# EAGLE design lpc1102_revb (EAGLE 6.5.0)
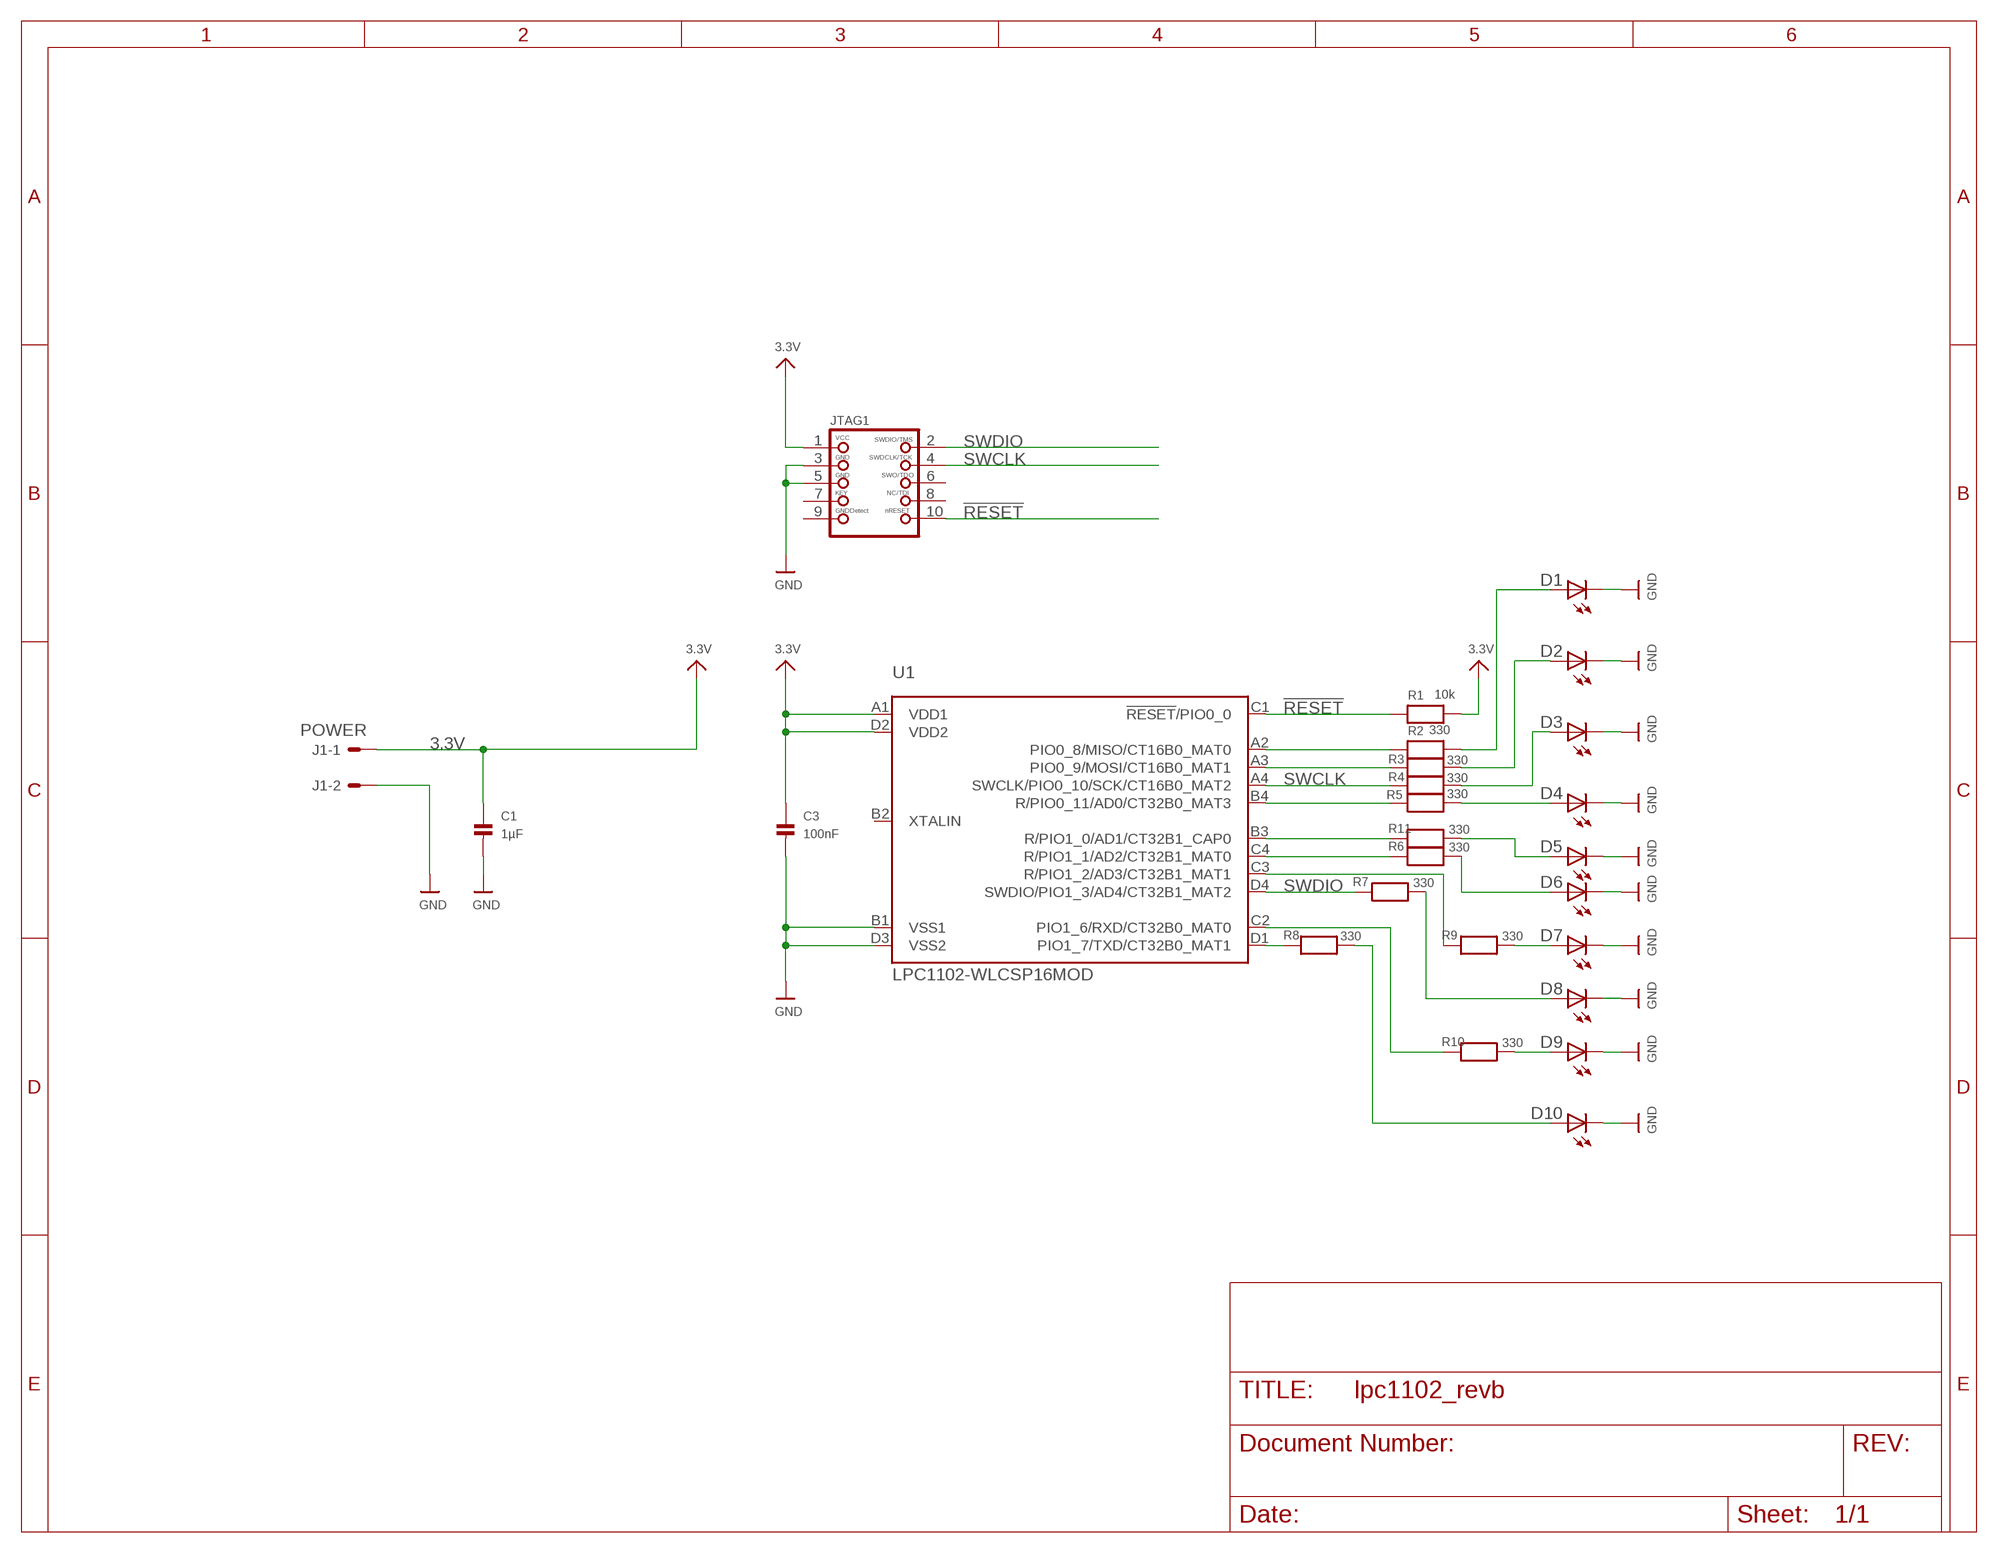
[diagram p0: schematic, sheet 1]

## Parts
C1  1µF  CAP_CERAMIC_0402  [_0402]
C3  100nF  CAP_CERAMIC_0402  [_0402]
D1  LEDCHIP-LED0603  [CHIP-LED0603]
D2  LEDCHIP-LED0603  [CHIP-LED0603]
D3  LEDCHIP-LED0603  [CHIP-LED0603]
D4  LEDCHIP-LED0603  [CHIP-LED0603]
D5  LEDCHIP-LED0603  [CHIP-LED0603]
D6  LEDCHIP-LED0603  [CHIP-LED0603]
D7  LEDCHIP-LED0603  [CHIP-LED0603]
D8  LEDCHIP-LED0603  [CHIP-LED0603]
D9  LEDCHIP-LED0603  [CHIP-LED0603]
D10  LEDCHIP-LED0603  [CHIP-LED0603]
J1  POWER  22-27-2021-02  [6410-02]
JTAG1  JTAG-CORTEXM3SMT  [2X05_1.27MM_SMT]
R1  10k  RESISTOR_0402  [_0402]
R2  330  RESISTOR_0402  [_0402]
R3  330  RESISTOR_0402  [_0402]
R4  330  RESISTOR_0402  [_0402]
R5  330  RESISTOR_0402  [_0402]
R6  330  RESISTOR_0402  [_0402]
R7  330  RESISTOR_0402  [_0402]
R8  330  RESISTOR_0402  [_0402]
R9  330  RESISTOR_0402  [_0402]
R10  330  RESISTOR_0402  [_0402]
R11  330  RESISTOR_0402  [_0402]
U1  LPC1102-WLCSP16MOD  [WLCSP16_MOD]

## Nets
3.3V: C1.1 C3.1 J1.1 JTAG1.1 R1.2 U1.A1(VDD1) U1.D2(VDD2)
!RESET: JTAG1.10 R1.1 U1.C1(!RESET!/PIO0_0)
GND: C1.2 C3.2 D1.C D2.C D3.C D4.C D5.C D6.C D7.C D8.C D9.C D10.C J1.2 JTAG1.3 JTAG1.5 U1.B1(VSS1) U1.D3(VSS2)
N$2: R8.1 U1.D1(PIO1_7/TXD/CT32B0_MAT1)
N$3: D1.A R2.2
N$4: R6.1 U1.C4(R/PIO1_1/AD2/CT32B1_MAT0)
N$5: R5.1 U1.B4(R/PIO0_11/AD0/CT32B0_MAT3)
N$6: D5.A R11.2
N$7: R3.1 U1.A3(PIO0_9/MOSI/CT16B0_MAT1)
N$8: R2.1 U1.A2(PIO0_8/MISO/CT16B0_MAT0)
N$9: R9.1 U1.C3(R/PIO1_2/AD3/CT32B1_MAT1)
N$10: D7.A R9.2
N$11: R10.1 U1.C2(PIO1_6/RXD/CT32B0_MAT0)
N$12: D9.A R10.2
N$13: R11.1 U1.B3(R/PIO1_0/AD1/CT32B1_CAP0)
N$22: D2.A R3.2
N$23: D3.A R4.2
N$24: D4.A R5.2
N$25: D6.A R6.2
N$30: D8.A R7.2
N$31: D10.A R8.2
SWCLK: JTAG1.4 R4.1 U1.A4(SWCLK/PIO0_10/SCK/CT16B0_MAT2)
SWDIO: JTAG1.2 R7.1 U1.D4(SWDIO/PIO1_3/AD4/CT32B1_MAT2)
Unconnected: JTAG1.6 JTAG1.7 JTAG1.8 JTAG1.9 U1.B2(XTALIN)

## Library data of the parts
C1 C3 = microbuilder_v3:CAP_CERAMIC: Ceramic Capacitors 0402 - 0402 Surface Mount Capacitors 16pF 50V 5% [Digikey: 445-4899-2-ND] 18pF 50V 5% [Digikey: 490-1281-2-ND] 22pF 50V 5% [Digikey: 490-1283-2-ND] 68pF 50V 5% [Digikey: 490-1289-2-ND] 0.1uF 10V 10% [Digikey: 490-1318-2-ND] 1.0uF 6.3V 10% [Digikey: 490-1320-2-ND] 0603 - 0603 Surface Mount Capacitors 16 pF 50V 5% [Digikey: 445-5051-2-ND] 22 pF 50V [Digikey: PCC220ACVTR-ND] 33 pF 50V 5% [Digikey: 490-1415-1-ND] 56pF 50V 5% [Digikey: 490-1421-1-ND] 220pF 50V 5% [Digikey: 445-1285-1-ND] 680 pF 50V 2200 pF 50V 5% C0G [Digikey: 445-1297-1-ND] 5600 pF 100V 5% X7R [Digikey: 478-3711-1-ND] 0.1 µF 25V 10% [Digikey: PCC2277TR-ND] 0.22 µF 16V 10% X7R [Digikey: 445-1318-1-ND] 1.0 µF 25V 10% [Digikey: 445-5146-2-ND] 0603 - RF Specific 3pF 250V +/-0.1pF RF [Digikey: 712-1347-1-ND] 18 pF 250V 5% [Digikey: 478-3505-1-ND or 712-1322-1-ND] 56 pF 250V 5% C0G RF [Digikey: 490-4867-1-ND] 68 pF 250V RF [Digikey: 490-4868-1-ND] 0805 - 0805 Surface Mount Capacitors 220 pF 250V 2% RF Ceramic Capacitor [Digikey: 712-1398-1-ND] 1000 pF 50V 2% NP0 Ceramic Capacitor [Digikey: 478-3760-1-ND] 0.1 µF 25V 10% Ceramic Capacitor [Digikey: PCC1828TR-ND] 1.0 µF 16V 10% Ceramic Capacitor[Digikey: 490-1691-2-ND] 10.0 µF 10V 10% Ceramic Capacitor[Digikey: 709-1228-1-ND] 10.0 uF 16V 10% Ceramic Capacitor [Digikey: 478-5165-2-ND] 47 uF 6.3V 20% Ceramic Capacitor [Digikey: 587-1779-1-ND or 399-5506-1-ND] 1206 - 1206 Surface Mount Capacitors 47uF 10V 20% Ceramic Capacitor [Digikey: 490-5528-1-ND or 399-5508-1-ND or 445-6010-1-ND] 100uF 6.3V -20%, +80% Y5V Ceramic Capacitor (Digikey: 490-4512-1-ND, Mouser: 81-GRM31CF50J107ZE1L)
D1-D10 = led:LED: LED OSRAM: - CHIPLED LG R971, LG N971, LY N971, LG Q971, LY Q971, LO R971, LY R971 LH N974, LH R974 LS Q976, LO Q976, LY Q976 LO Q996 - Hyper CHIPLED LW Q18S LB Q993, LB Q99A, LB R99A - SideLED LS A670, LO A670, LY A670, LG A670, LP A670 LB A673, LV A673, LT A673, LW A673 LH A674 LY A675 LS A676, LA A676, LO A676, LY A676, LW A676 LS A679, LY A679, LG A679 - Hyper Micro SIDELED® LS Y876, LA Y876, LO Y876, LY Y876 LT Y87S - SmartLED LW L88C, LW L88S LB L89C, LB L89S, LG L890 LS L89K, LO L89K, LY L89K LS L896, LA L896, LO L896, LY L896 - TOPLED LS T670, LO T670, LY T670, LG T670, LP T670 LSG T670, LSP T670, LSY T670, LOP T670, LYG T670 LG T671, LOG T671, LSG T671 LB T673, LV T673, LT T673, LW T673 LH T674 LS T676, LA T676, LO T676, LY T676, LB T676, LH T676, LSB T676, LW T676 LB T67C, LV T67C, LT T67C, LS T67K, LO T67K, LY T67K, LW E67C LS E67B, LA E67B, LO E67B, LY E67B, LB E67C, LV E67C, LT E67C LW T67C LS T679, LY T679, LG T679 LS T770, LO T770, LY T770, LG T770, LP T770 LB T773, LV T773, LT T773, LW T773 LH T774 LS E675, LA E675, LY E675, LS T675 LS T776, LA T776, LO T776, LY T776, LB T776 LHGB T686 LT T68C, LB T68C - Hyper Mini TOPLED® LB M676 - Mini TOPLED Santana® LG M470 LS M47K, LO M47K, LY M47K Source: http://www.osram.convergy.de LUXEON: - LUMILED® LXK2-PW12-R00, LXK2-PW12-S00, LXK2-PW14-U00, LXK2-PW14-V00 LXK2-PM12-R00, LXK2-PM12-S00, LXK2-PM14-U00 LXK2-PE12-Q00, LXK2-PE12-R00, LXK2-PE12-S00, LXK2-PE14-T00, LXK2-PE14-U00 LXK2-PB12-K00, LXK2-PB12-L00, LXK2-PB12-M00, LXK2-PB14-N00, LXK2-PB14-P00, LXK2-PB14-Q00 LXK2-PR12-L00, LXK2-PR12-M00, LXK2-PR14-Q00, LXK2-PR14-R00 LXK2-PD12-Q00, LXK2-PD12-R00, LXK2-PD12-S00 LXK2-PH12-R00, LXK2-PH12-S00 LXK2-PL12-P00, LXK2-PL12-Q00, LXK2-PL12-R00 Source: www.luxeon.com KINGBRIGHT: KA-3528ASYC Source: www.kingbright.com
J1 = con-molex:22-?-02: CONNECTOR wire to board 2.54 mm (.1 inch) pitch header; OC_FARNELL: unknown; OC_NEWARK: unknown
JTAG1 = microbuilder_v3:JTAG-CORTEXM3: Serial Wire (SW-DP) Connector This standard 0.05" 10-pin connector is for use with the Cortex M0/M3's native SWD (serial wire debugger) interface (SW-DP). Some boards support a 20-pin combined JTAG+SWD connector (SWJ-DP), such as the LPC1700 family, but many smaller devices only work with SWD which typically use the smaller 10-pin SW-DP connecter (the LPC1300 family, for example, only supports SWD). 2x05 1.27mm/0.05" Connector: This is the standard SMT connector defined by ARM for all Cortex devices, and should be used in most situations and for forward-compatibility since any new devices coming to market will likely use this connector. MOLEX 10 Pin 0.1" Connector: This 0.1" 10 pin connector has the same pin layout as the standard 0.05" connector, but is easier to work with if you are using standard jumper wires or custom cables to connect your SWD hardware. MOLEX 20 Pin 0.1" Connector: This 0.1" 20 pin connector is the same model used for ARM7/ARM9 JTAG debuggers, but is connected to match the pins on the Segger J-Link for ARM (which supports both JTAG and SWD debugging). See the following document from ARM for more information on Cortex M3 Debug Connectors: http://infocenter.arm.com/help/topic/com.arm.doc.faqs/attached/13634/cortex_debug_connectors.pdf And the following page for an overview with images of the different connector types: http://www.keil.com/peripherals/coresight/connectors.asp
R1-R11 = microbuilder_v3:RESISTOR: Resistors 0402 - 0402 Surface Mount Package 22 Ohm 1% 1/16W [Digikey: 311-22.0LRTR-ND] 33 Ohm 5% 1/16W 1.0K 5% 1/16W 1.5K 5% 1/16W 2.0K 1% 1/16W 10.0K 1% 1/16W [Digikey: 311-10.0KLRTR-ND] 10.0K 5% 1/16W [Digikey: RMCF0402JT10K0TR-ND] 12.1K 1% 1/16W [Digikey: 311-22.0LRTR-ND] 100.0K 5% 1/16W 0603 - 0603 Surface Mount Package 0 Ohm 1/10 Watt 1% Resistor 15 Ohm 1/10 Watt 1% Resistor 33 Ohm 1/10 Watt 1% Resistor 49.9 Ohm 1/10 Watt 1% Resistor 100 Ohm 1/10 Watt 1% Resistor 150 Ohm 1/10 Watt 1% Resistor 240 Ohm 1/10 Watt 1% Resistor 390 Ohm 1/10 Watt 1% Resistor 560 Ohm 1/10 Watt 1% Resistor 680 Ohm 1/10 Watt 1% Resistor 750 Ohm 1/10 Watt 1% Resistor 1.0K Ohm 1/10 Watt 1% Resistor 1.5K Ohm 1/10 Watt 1% Resistor 2.0K Ohm 1/10 Watt 1% Resistor 2.2K Ohm 1/10 Watt 1% Resistor 3.3K Ohm 1/10 Watt 1% Resistor 4.7K Ohm 1/10 Watt 1% Resistor 10.0K Ohm 1/10 Watt 1% Resistor 12.0K Ohm 1/10 Watt 1% Resistor 12.1K Ohm 1/10 Watt 1% Resistor 20.0K Ohm 1/10 Watt 1% Resistor 33.0K Ohm 1/10 Watt 1% Resistor 100.0K Ohm 1/10 Watt 1% Resistor 0805 - 0805 Surface Mount Package 0 Ohm 1/8 Watt 1% Resistor 33 Ohm 1/8 Watt 1% Resistor 100 Ohm 1/8 Watt 1% Resistor 150 Ohm 1/8 Watt 1% Resistor 200 Ohm 1/8 Watt 1% Resistor 240 Ohm 1/8 Watt 1% Resistor 330 Ohm 1/8 Watt 1% Resistor 390 Ohm 1/8 Watt 1% Resistor 470 Ohm 1/8 Watt 1% Resistor 1.0K Ohm 1/8 Watt 1% Resistor 1.5K Ohm 1/8 Watt 1% Resistor 2.0K Ohm 1/8 Watt 1% Resistor 4.7K Ohm 1/8 Watt 1% Resistor 5.1K Ohm 1/8 Watt 1% Resistor 5.6K Ohm 1/8 Watt 1% Resistor 10.0K Ohm 1/8 Watt 1% Resistor 22.0K Ohm 1/8 Watt 1% Resistor 33.0K Ohm 1/8 Watt 1% Resistor 100K Ohm 1/8 Watt 1% Resistor 1206 - 1206 Surface Mount Package 2012 - 2010 Surface Mount Package 0.11 Ohm 1/2 Watt 1% Resistor - Digikey: RHM.11UCT-ND
U1 = lpc1102_test:LPC1102-WLCSP16: NXP Semiconductors LPC1102 microcontroller <http://ics.nxp.com/products/lpc1000/lpc11xx/lpc1102/> ARM 32-bit Cortex-M0 Microcontroller with MPU CPU clock up to 50MHz 32KByte on-chip Flash ROM with In-System Programming (ISP) and In-Application Programming (IAP) via On-Chip Bootloader 8KByte SRAM Nested Vectored Interrupt Controller SPI controller UART with full Modem Interface and RS485 Support 4 Timers with 4 capture channels and 13 output channels Watchdog (WDT) Sytem tick timer 10-bit ADC with 5 channels Power Management Unit (PMU) Brownout detection 12MHz internal RC oscillator Serial Wire Debug/Trace port

## Board
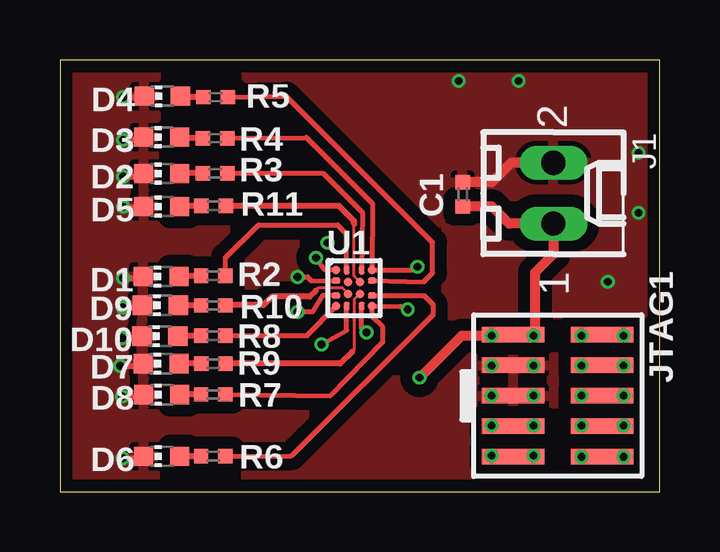
[diagram p1: board, top side]
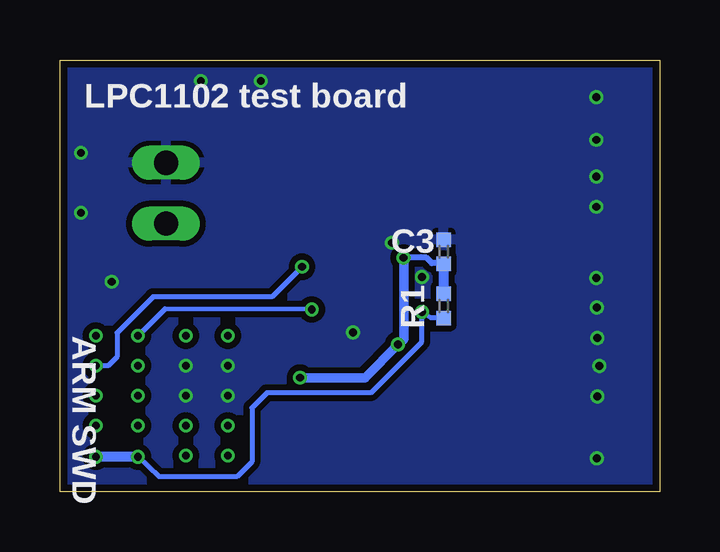
[diagram p2: board, bottom side, seen from below]

Size 25 x 18 mm. Coordinates in mm from the lower left corner, seen from the top.
Outline: 0,0 25,0 25,18 0,18 0,0
Copper layers (1*16): Top 0.035mm / dielectric 1.5mm / Bottom 0.035mm
Design rules "default *": minimum track width 0.125mm, minimum drill 0.2mm, track to track 0.125mm, track to pad 0.125mm, pad to pad 0.125mm, via to via 0.125mm, smd to smd 0.125mm, copper to edge 0.3mm, drill to drill 0.2mm, minimum pad ring 0.2mm, minimum via ring 0.125mm, stop-mask expansion 0.075mm, vias tented up to drill 13mil, thermal gap 0.2mm

### Footprints (pad centres in the part's own frame; a part is rotated, then mirrored left to right if it is on the bottom)
_0402 = smd 0.6 x 0.6: 1 -0.508,0; 2 0.508,0
CHIP-LED0603 = smd 0.8 x 0.8: A 0,-0.75; C 0,0.75
6410-02 = drill 1.016 long: 1 1.27,0; 2 -1.27,0
2X05_1.27MM_SMT = smd 0.65 x 2.6: 1 -2.54,-1.85; 2 -2.54,1.85; 3 -1.27,-1.85; 4 -1.27,1.85; 5 0,-1.85; 6 0,1.85; 7 1.27,-1.85; 8 1.27,1.85; 9 2.54,-1.85; 10 2.54,1.85
WLCSP16_MOD = smd 0.35 x 0.35: A1 -0.75,0.75; A4 0.75,0.75; B2 -0.25,0.25; B3 0.25,0.25; C2 -0.25,-0.25; C3 0.25,-0.25; D1 -0.75,-0.75; D4 0.75,-0.75 | smd 0.25 x 0.35: A2 -0.31,0.75; A3 0.31,0.75; D2 -0.31,-0.75; D3 0.31,-0.75 | smd 0.35 x 0.25: B1 -0.75,0.31; B4 0.75,0.31; C1 -0.75,-0.31; C4 0.75,-0.31

### Placement (x,y rotation side)
C1  16.79,12.39 90 top
C3  9,10 90 bottom
D1  4.22,8.97 90 top
D2  4.24,13.26 90 top
D3  4.24,14.78 90 top
D4  4.27,16.48 90 top
D5  4.24,11.89 90 top
D6  4.24,1.47 90 top
D7  4.22,5.33 90 top
D8  4.24,4.04 90 top
D9  4.19,7.77 90 top
D10  4.17,6.48 90 top
J1  20.57,12.45 270 top
JTAG1  20.75,4 270 top
R1  9,7.74 90 bottom
R2  6.39,9 180 top
R3  6.47,13.28 180 top
R4  6.47,14.74 180 top
R5  6.49,16.45 180 top
R6  6.39,1.47 180 top
R7  6.39,4.05 180 top
R8  6.39,6.5 180 top
R9  6.4,5.34 180 top
R10  6.39,7.76 180 top
R11  6.41,11.91 180 top
U1  12.27,8.48 0 top

### Tracks (layer width: path | path; a pad name or v marks a point on that pad's centre or on a via)
3.3V  (via drill 0.33)
  Top 0.2: v10.9,6.13 11.96,6.72 U1.D2 | U1.A1 11.03,9.25 10.76,9.62 v10.67,9.75 | v18,6.5 v19.75,6.5 18.94,6.5 JTAG1.1
  Top 0.406: v19.75,6.5 19.81,6.56 19.81,9.14 20.57,9.91 J1.1 18.72,11.18 18.01,11.89 C1.1 | v18,6.5 16.74,6.5 v14.99,4.75 | C1.1
  Bottom 0.254: C3.1 9.06,9.52 9.5,9.52 9.73,9.75 v10.66,9.75 v10.67,9.75
  Bottom 0.4: v14.99,4.75 12.28,4.75 v10.9,6.13 10.66,6.38 10.66,9.76 v10.67,9.75
  Bottom 0.406: C3.1 R1.2
!RESET  (via drill 0.33)
  Top 0.2: U1.C1 10.96,8.17 10.53,7.5 v9.91,7.5
  Top 0.406: v21.75,1.45 22.59,1.45 JTAG1.10
  Bottom 0.2: R1.1 9.03,7.24 9.54,7.24 v9.91,7.5 9.91,6.25 12.03,4.12 16.38,4.12 17,3.5 17,1.25 17.62,0.62 20.88,0.62 v21.75,1.45
  Bottom 0.406: v21.75,1.45 v23.5,1.45
GND  (via drill 0.33)
  Top 0.2: v12.79,6.64 12.58,6.79 U1.D3 | v9.91,8.95 10.32,8.95 10.49,8.79 U1.B1
  Top 0.254: v2.64,16.45 3.48,16.45 D4.C | v2.64,14.67 3.38,14.67 D3.C | v2.64,13.14 3.38,13.14 D2.C | v2.64,11.87 3.48,11.87 D5.C | v2.64,8.9 3.4,8.9 D1.C | v2.62,7.68 3.35,7.68 D9.C | v2.59,6.41 3.35,6.41 D10.C | v2.52,5.25 3.38,5.25 D7.C | v2.59,3.98 3.43,3.98 D8.C | v2.62,1.38 3.4,1.38 D6.C
  Top 0.406: J1.2 18.82,13.72 18.01,12.9 C1.2 | C1.2
  other vias: 18,5.25 19.75,5.25 18,4 19.75,4 11.16,10.38 22.84,8.75 16.62,17.12 19.12,17.12 24.12,14.12 24.12,11.62
  pour Top (isolate 0.508): 25,0 0,0 0,18 25,18
  pour Bottom (isolate 0.254): 0,0 25,0 25,18 0,18
N$2
  Top 0.2: U1.D1 10.28,6.5 R8.1
N$3
  Top 0.254: R2.2 5,9 D1.A
N$4
  Top 0.2: U1.C4 15.18,8.17 15.56,7.8 15.56,7.38 9.66,1.5 R6.1
N$5
  Top 0.2: U1.B4 15.16,8.75 15.53,9.12 15.53,10.39 9.42,16.5 R5.1
N$6
  Top 0.254: R11.2 5.02,11.91 D5.A
N$7
  Top 0.2: U1.A3 12.61,11.64 10.97,13.28 R3.1
N$8
  Top 0.2: U1.A2 11.96,10.75 11.58,11.12 8.29,11.12 6.9,9.77 R2.1
N$9
  Top 0.127: U1.C3 12.5,8.23 12.27,8 12.27,5.92 12.19,5.84
  Top 0.254: 12.19,5.84 11.68,5.33 7.79,5.33 R9.1
N$10
  Top 0.254: R9.2 D7.A
N$11
  Top 0.127: U1.C2 12.02,8.25 11.79,8.48 10.77,8.48 10.67,8.38
  Top 0.254: 10.67,8.38 10.41,8.13 8.84,8.13 8.48,7.77 6.91,7.77 R10.1
N$12
  Top 0.254: R10.2 4.95,7.76 D9.A
N$13
  Top 0.127: U1.B3 12.52,8.74 12.27,8.99 12.27,11.18
  Top 0.254: 12.27,11.18 12.27,11.28 11.63,11.91 7.86,11.91 R11.1
N$14  (via drill 0.33)
  other vias: 18,1.5
N$15  (via drill 0.33)
  other vias: 19.75,1.5
N$16  (via drill 0.33)
  other vias: 19.75,2.75
N$17  (via drill 0.33)
  other vias: 18,2.75
N$22
  Top 0.254: R3.2 5.01,13.28 D2.A
N$23
  Top 0.254: R4.2 5.04,14.74 D3.A
N$24
  Top 0.254: R5.2 5.05,16.45 D4.A
N$25
  Top 0.254: R6.2 D6.A
N$26  (via drill 0.33)
  other vias: 23.5,2.75
N$27  (via drill 0.33)
  other vias: 21.75,2.75
N$28  (via drill 0.33)
  other vias: 21.75,4
N$29  (via drill 0.33)
  other vias: 23.5,4
N$30
  Top 0.254: R7.2 5,4.05 D8.A
N$31
  Top 0.254: R8.2 4.94,6.5 D10.A
SWCLK  (via drill 0.33)
  Top 0.2: v14.91,9.38 14.78,9.25 U1.A4 13.03,12.01 10.28,14.76 R4.1 | v21.75,5.25 22.58,5.25 JTAG1.4 23.48,5.27 v23.5,5.25
  Bottom 0.2: v14.91,9.38 16.16,8.12 21.12,8.12 22.62,6.62 22.62,5.62 23,5.25 v23.5,5.25
SWDIO  (via drill 0.33)
  Top 0.2: v14.5,7.6 14.2,7.72 U1.D4 13.03,7.29 13.46,6.86 13.46,6.24 11.28,4 R7.1 | v21.75,6.5 22.56,6.5 JTAG1.2 22.64,6.5 v23.5,6.5
  Bottom 0.2: v14.5,7.6 20.62,7.62 v21.75,6.5

### Text on the board
bPlace: LPC1102 test board | ARM SWD